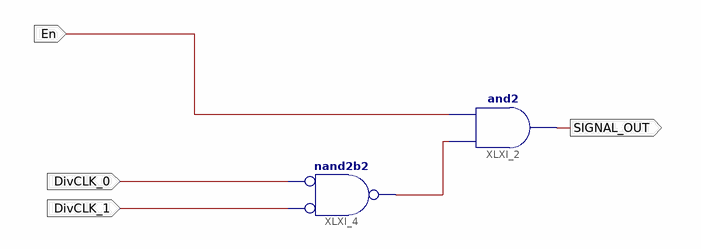
[diagram p0: schematic sheet 1]
// Xilinx ISE schematic YOGI_ST.sch (spartan3e) as structural Verilog: 2 symbols, 4 ports
module YOGI_ST (
  input  DivCLK_0,
  input  DivCLK_1,
  input  En,
  output SIGNAL_OUT
);

  wire XLXN_5;

  and XLXI_2 (SIGNAL_OUT, XLXN_5, En);
  nand XLXI_4 (XLXN_5, ~DivCLK_0, ~DivCLK_1);  // nand2b2
endmodule
